# Altium schematic sheet [05] - LEDS.SchDoc
size A4
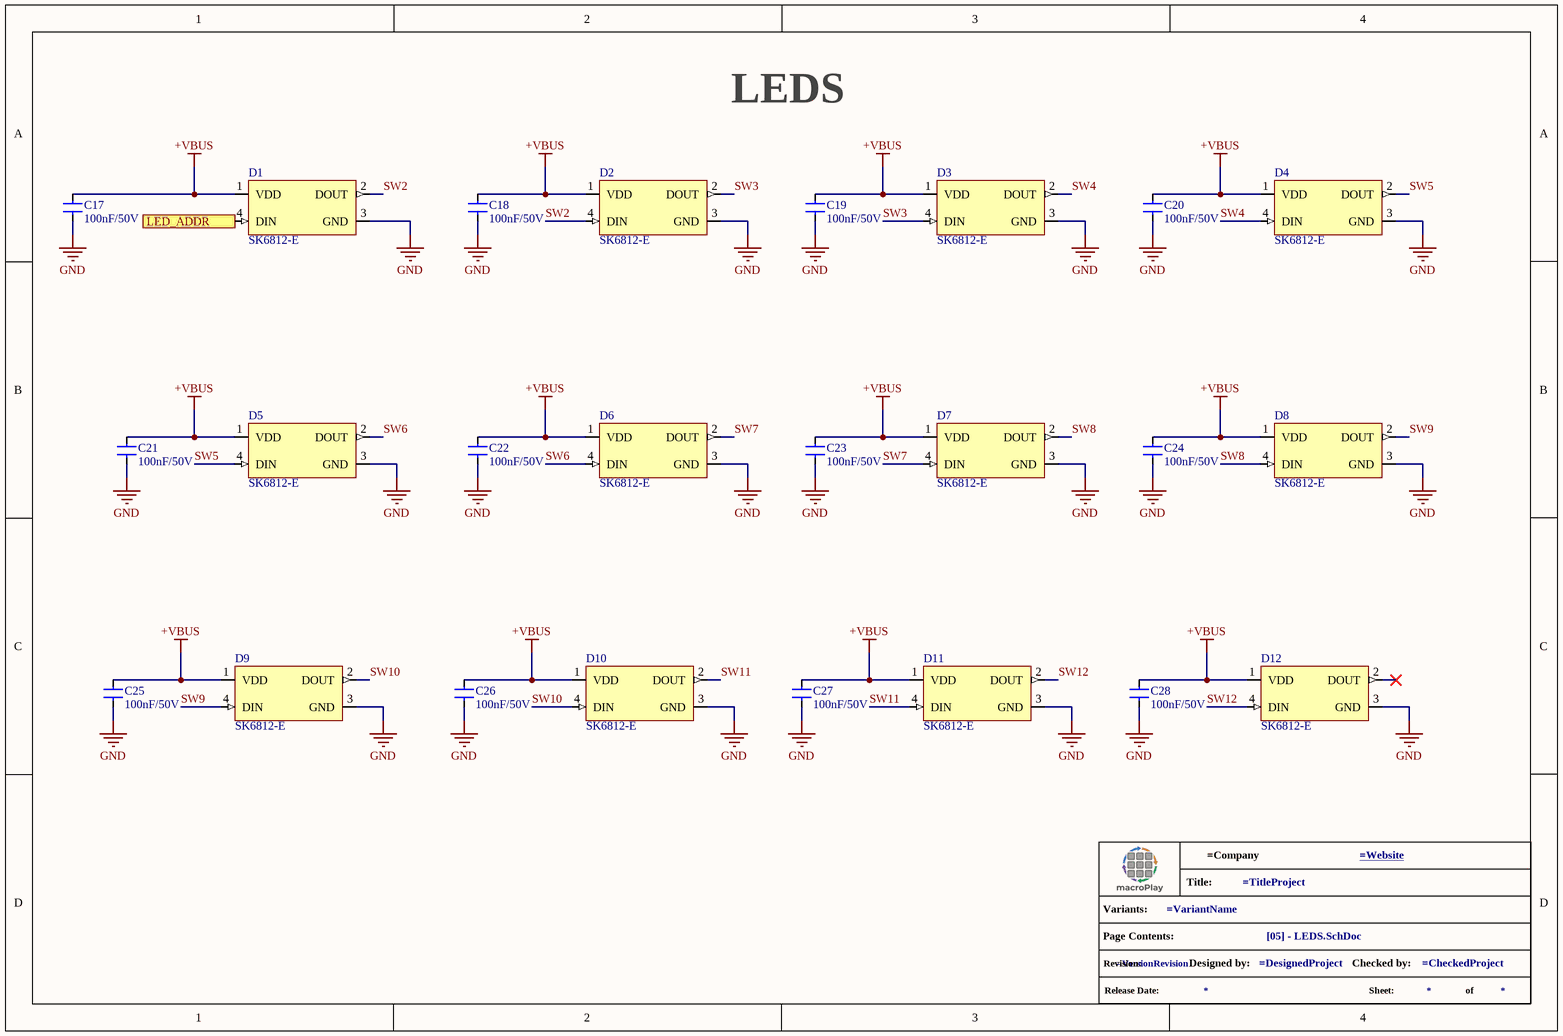
[diagram p0: [05] - LEDS.SchDoc]

## Parts
C17  100nF/50V  [C0805 - ironsoldering]
C18  100nF/50V  [C0805 - ironsoldering]
C19  100nF/50V  [C0805 - ironsoldering]
C20  100nF/50V  [C0805 - ironsoldering]
C21  100nF/50V  [C0805 - ironsoldering]
C22  100nF/50V  [C0805 - ironsoldering]
C23  100nF/50V  [C0805 - ironsoldering]
C24  100nF/50V  [C0805 - ironsoldering]
C25  100nF/50V  [C0805 - ironsoldering]
C26  100nF/50V  [C0805 - ironsoldering]
C27  100nF/50V  [C0805 - ironsoldering]
C28  100nF/50V  [C0805 - ironsoldering]
D1  SK6812-E  [LED_SK6812-E]
D2  SK6812-E  [LED_SK6812-E]
D3  SK6812-E  [LED_SK6812-E]
D4  SK6812-E  [LED_SK6812-E]
D5  SK6812-E  [LED_SK6812-E]
D6  SK6812-E  [LED_SK6812-E]
D7  SK6812-E  [LED_SK6812-E]
D8  SK6812-E  [LED_SK6812-E]
D9  SK6812-E  [LED_SK6812-E]
D10  SK6812-E  [LED_SK6812-E]
D11  SK6812-E  [LED_SK6812-E]
D12  SK6812-E  [LED_SK6812-E]
GPH?  info_project  (value not drawn)  (graphical)

## Ports
LED_ADDR (in)

## Nets
+VBUS: C17.2 C18.2 C19.2 C20.2 C21.2 C22.2 C23.2 C24.2 C25.2 C26.2 C27.2 C28.2 D1.1(VDD) D2.1(VDD) D3.1(VDD) D4.1(VDD) D5.1(VDD) D6.1(VDD) D7.1(VDD) D8.1(VDD) D9.1(VDD) D10.1(VDD) D11.1(VDD) D12.1(VDD)
GND: C17.1 C18.1 C19.1 C20.1 C21.1 C22.1 C23.1 C24.1 C25.1 C26.1 C27.1 C28.1 D1.3(GND) D2.3(GND) D3.3(GND) D4.3(GND) D5.3(GND) D6.3(GND) D7.3(GND) D8.3(GND) D9.3(GND) D10.3(GND) D11.3(GND) D12.3(GND)
LED_ADDR: D1.4(DIN) ; port LED_ADDR
SW2: D1.2(DOUT) D2.4(DIN)
SW3: D2.2(DOUT) D3.4(DIN)
SW4: D3.2(DOUT) D4.4(DIN)
SW5: D4.2(DOUT) D5.4(DIN)
SW6: D5.2(DOUT) D6.4(DIN)
SW7: D6.2(DOUT) D7.4(DIN)
SW8: D7.2(DOUT) D8.4(DIN)
SW9: D8.2(DOUT) D9.4(DIN)
SW10: D9.2(DOUT) D10.4(DIN)
SW11: D10.2(DOUT) D11.4(DIN)
SW12: D11.2(DOUT) D12.4(DIN)

Not connected (* = marked no-connect by the designer): D12 2(DOUT)*

## Notes on the sheet
- LEDS
- (in symbol info_project) Title:; Variants:; Page Contents:; Revision:; Designed by:; Checked by:; Release Date:; Sheet:; of

## Library data of the parts
C17-C28 = CL21B104KBCNNNC: MLCC - 100nF 50V X7R 0805 ±10%; Manufacturer: Samsung Electro-Mechanics; Dielectric Material: Ceramic; .Mounting: SMD; Supplier: Future Electronics; Supplier Part Number: CL21B104KBCNNNC; Manufacturer Part Number: CL21B104KBCNNNC; RoHS: Compliant; Category: Ceramic Capacitors; Stock: 6136000; Pricing: 4000=0,0059, 16000=0,0057, 60000=0,0055, 100000=0,0054, 200000=0,0052 (USD); Value: 100nF; Case/Package: 0805; Case Code (Imperial): 0805; Case Code (Metric): 2012; China RoHS: Compliant; Contact Plating: Tin; Country of Origin: Mainland China, Philippines, South Korea; Depth: 1.25mm; Dielectric: X7R; Export Control Classification Number (ECCN) Code: EAR99; Height: 950µm; Harmonized Tariff Schedule (HTS) Code: 8532.24.00.20; Introduction Date: 2009-07-27; Lead Free: Lead Free; Length: 2mm; Lifecycle Status: Production; Material: Ceramic; Max Operating Temperature: 125°C; Min Operating Temperature: -55°C; Mounting Technology: Surface Mount; Number of Terminals: 2; Radiation Hardening: No; REACH SVHC: Yes; Schedule B: 8532240020, 8532240020|8532240020, 8532240020|8532240020|8532240020, 8532240020|8532240020|8532240020|8532240020; Thickness: 939.8µm; Tolerance: 10%; Voltage: 50V; Voltage Rating: 50V; Voltage Rating (DC): 50V; Width: 1.25mm; ComponentLink1URL: https://datasheet.octopart.com:443/CL21B104KBCNNNC-Samsung-Electro-Mechanics-datasheet-137745078.pdf?src-supplier=IHS; ComponentLink1Description: https://datasheet.octopart.com:443/CL21B104KBCNNNC-Samsung-Electro-Mechanics-datasheet-137745078.pdf?src-supplier=IHS; ComponentLink2URL: https://datasheet.octopart.com/CL21B104KBCNNNC-Samsung-Electro-Mechanics-datasheet-8324245.pdf; ComponentLink2Description: https://datasheet.octopart.com/CL21B104KBCNNNC-Samsung-Electro-Mechanics-datasheet-8324245.pdf; ComponentLink3URL: https://datasheet.octopart.com/CL21B104KBCNNNC-Samsung-Electro-Mechanics-datasheet-97040617.pdf; ComponentLink3Description: https://datasheet.octopart.com/CL21B104KBCNNNC-Samsung-Electro-Mechanics-datasheet-97040617.pdf; ComponentLink4URL: https://datasheet.octopart.com/General-Multilayer-Ceramic-Capacitors-Samsung-datasheet-family-111.pdf; ComponentLink4Description: https://datasheet.octopart.com/General-Multilayer-Ceramic-Capacitors-Samsung-datasheet-family-111.pdf; ComponentLink5URL: https://datasheet.octopart.com:443/CL21B104KBCNNNC-Samsung-Electro-Mechanics-datasheet-11548950.pdf?src-supplier=Future+Electronics; ComponentLink5Description: https://datasheet.octopart.com:443/CL21B104KBCNNNC-Samsung-Electro-Mechanics-datasheet-11548950.pdf?src-supplier=Future+Electronics; ComponentLink6URL: https://datasheet.octopart.com:443/CL21B104KBCNNNC-Samsung-Electro-Mechanics-datasheet-116891032.pdf?src-supplier=Future+Electronics; ComponentLink6Description: https://datasheet.octopart.com:443/CL21B104KBCNNNC-Samsung-Electro-Mechanics-datasheet-116891032.pdf?src-supplier=Future+Electronics; ComponentLink7URL: https://datasheet.octopart.com:443/CL21B104KBCNNNC-Samsung-Electro-Mechanics-datasheet-81462175.pdf?src-supplier=Future+Electronics; ComponentLink7Description: https://datasheet.octopart.com:443/CL21B104KBCNNNC-Samsung-Electro-Mechanics-datasheet-81462175.pdf?src-supplier=Future+Electronics; ComponentLink8URL: https://datasheet.octopart.com:443/CL21B104KBCNNNC-Samsung-datasheet-42485244.pdf?src-supplier=Future+Electronics; ComponentLink8Description: https://datasheet.octopart.com:443/CL21B104KBCNNNC-Samsung-datasheet-42485244.pdf?src-supplier=Future+Electronics; ComponentLink9URL: https://datasheet.octopart.com:443/CL21B104KBCNNNC-Samsung-Electro-Mechanics-datasheet-149045937.pdf?src-supplier=Future+Electronics; ComponentLink9Description: https://datasheet.octopart.com:443/CL21B104KBCNNNC-Samsung-Electro-Mechanics-datasheet-149045937.pdf?src-supplier=Future+Electronics; ComponentLink10URL: https://datasheet.octopart.com:443/CL21B104KBCNNNC-Samsung-datasheet-8326407.pdf?src-supplier=TME; ComponentLink10Description: https://datasheet.octopart.com:443/CL21B104KBCNNNC-Samsung-datasheet-8326407.pdf?src-supplier=TME; ComponentLink11URL: http://sigma.octopart.com:80/rohs_certificate/General-Multilayer-Ceramic-Capacitors-Samsung-family-110.pdf?src-supplier=Compliance+Statements; ComponentLink11Description: http://sigma.octopart.com:80/rohs_certificate/General-Multilayer-Ceramic-Capacitors-Samsung-family-110.pdf?src-supplier=Compliance+Statements; ComponentLink12URL: http://sigma.octopart.com:80/rohs_statement/General-Multilayer-Ceramic-Capacitors-Samsung-family-132.pdf?src-supplier=Compliance+Statements; ComponentLink12Description: http://sigma.octopart.com:80/rohs_statement/General-Multilayer-Ceramic-Capacitors-Samsung-family-132.pdf?src-supplier=Compliance+Statements; ComponentLink13URL: http://sigma.octopart.com:80/reach_statement/General-Multilayer-Ceramic-Capacitors-Samsung-family-133.pdf?src-supplier=Compliance+Statements; ComponentLink13Description: http://sigma.octopart.com:80/reach_statement/General-Multilayer-Ceramic-Capacitors-Samsung-family-133.pdf?src-supplier=Compliance+Statements; .SCHChecked: *; .PCBChecked: *
D1-D12 = SK6812-E: DIODE - SK6812MINI-E is a smart LED control circuit and light emitting circuit in one controlled LED source, which has the shape of a 3528 LED chip.; MF: DONGGUANG OPSCO OPTOELECTRONICS CO., LTD; SnapEDA_Link: https://www.snapeda.com/parts/SK6812-E/DONGGUANG+OPSCO+OPTOELECTRONICS+CO.%252C+LTD/view-part/?ref=snap; Package: Package; Value: *; MP: SK6812-E; Check_prices: https://www.snapeda.com/parts/SK6812-E/DONGGUANG+OPSCO+OPTOELECTRONICS+CO.%252C+LTD/view-part/?ref=eda
GPH? = info_project: GRAPHICAL - Info Project